# Altium schematic sheet Open Reactor Control System - Machine Interface MCU.SchDoc: ORC - Machine Interface MCU
size A3; Author: Peake J; CompanyName: Scion Research; DrawnBy: Peake J; Engineer: Peake J; Organization: Scion; Address1: 49 Sala St; Address2: Whakarewarewa; Address3: Rotorua; Address4: New Zealand 3010; DocumentNumber: 0-4; Revision: 0; SheetNumber: 3; SheetTotal: 5
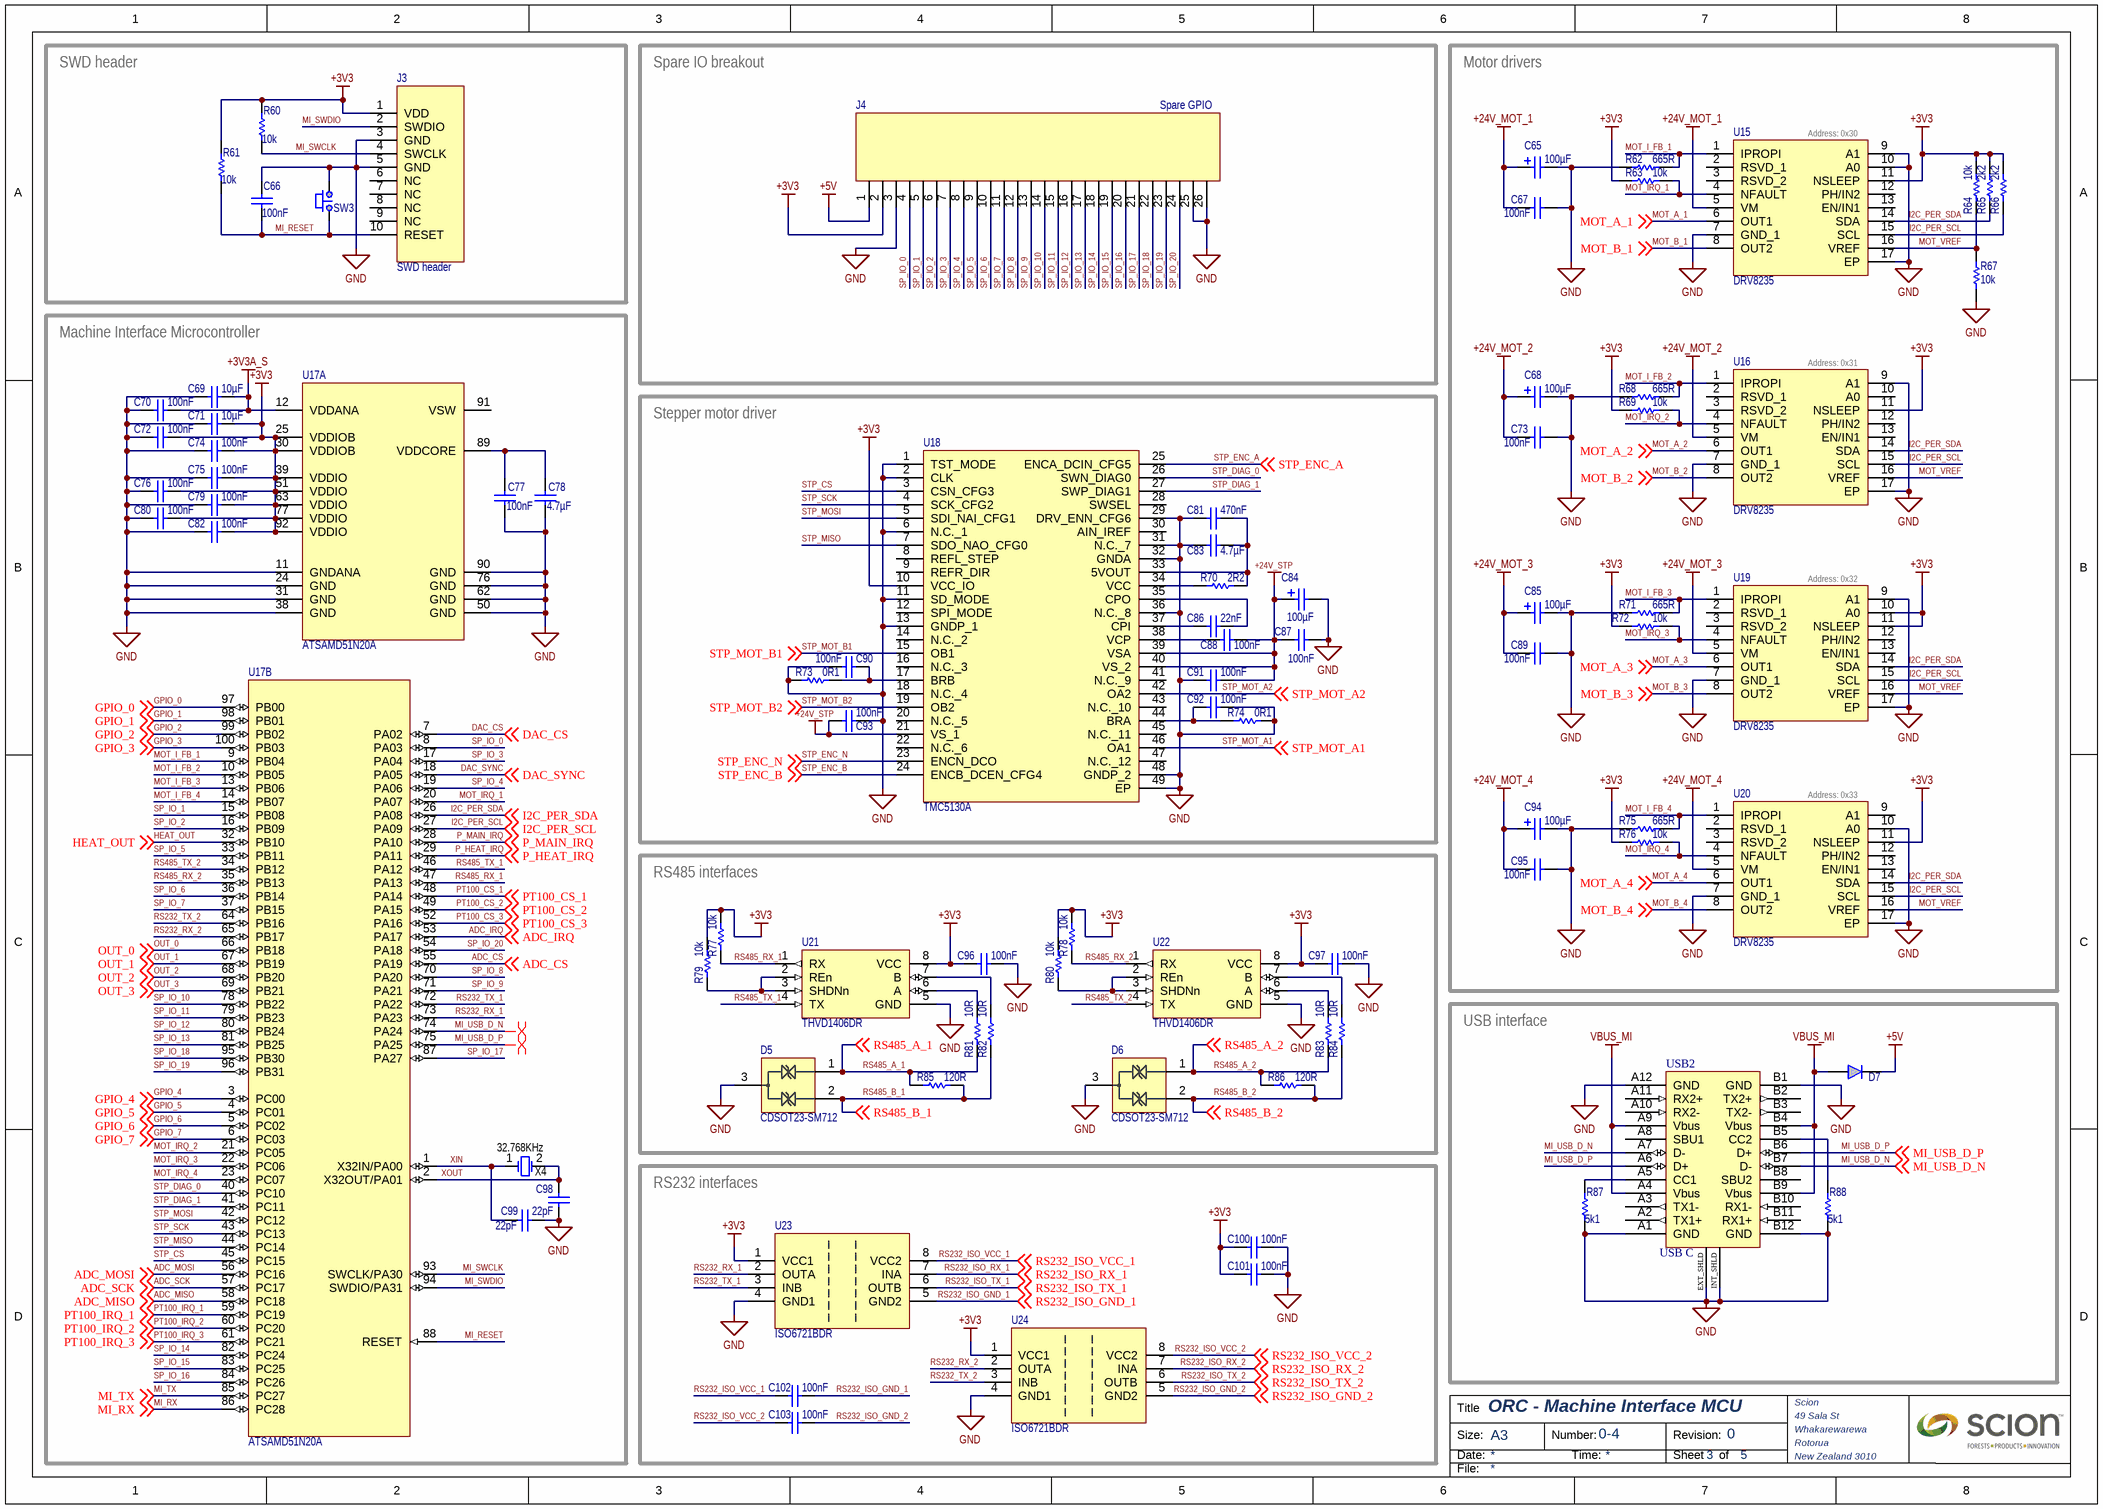
[diagram p0: Open Reactor Control System - Machine Interface MCU.SchDoc]

## Parts
C65  value 100µF  [CAP_PANA_F12_SIZE]  (hidden comment: Capacitor Electrolytic)
C66  value 100nF  [0603_CAP]  (hidden comment: Capacitor)
C67  value 100nF  [0603_CAP]  (hidden comment: Capacitor)
C68  value 100µF  [CAP_PANA_F12_SIZE]  (hidden comment: Capacitor Electrolytic)
C69  value 10µF  [0603_CAP]  (hidden comment: Capacitor)
C70  value 100nF  [0402_CAP]  (hidden comment: Capacitor)
C71  value 10µF  [0603_CAP]  (hidden comment: Capacitor)
C72  value 100nF  [0402_CAP]  (hidden comment: Capacitor)
C73  value 100nF  [0603_CAP]  (hidden comment: Capacitor)
C74  value 100nF  [0402_CAP]  (hidden comment: Capacitor)
C75  value 100nF  [0402_CAP]  (hidden comment: Capacitor)
C76  value 100nF  [0402_CAP]  (hidden comment: Capacitor)
C77  value 100nF  [0402_CAP]  (hidden comment: Capacitor)
C78  value 4.7µF  [0603_CAP]  (hidden comment: Capacitor)
C79  value 100nF  [0402_CAP]  (hidden comment: Capacitor)
C80  value 100nF  [0402_CAP]  (hidden comment: Capacitor)
C81  value 470nF  [0603_CAP]  (hidden comment: Capacitor)
C82  value 100nF  [0402_CAP]  (hidden comment: Capacitor)
C83  value 4.7µF  [0603_CAP]  (hidden comment: Capacitor)
C84  value 100µF  [CAP_PANA_F12_SIZE]  (hidden comment: Capacitor Electrolytic)
C85  value 100µF  [CAP_PANA_F12_SIZE]  (hidden comment: Capacitor Electrolytic)
C86  value 22nF  [0603_CAP]  (hidden comment: Capacitor)
C87  value 100nF  [0603_CAP]  (hidden comment: Capacitor)
C88  value 100nF  [0603_CAP]  (hidden comment: Capacitor)
C89  value 100nF  [0603_CAP]  (hidden comment: Capacitor)
C90  value 100nF  [0603_CAP]  (hidden comment: Capacitor)
C91  value 100nF  [0603_CAP]  (hidden comment: Capacitor)
C92  value 100nF  [0603_CAP]  (hidden comment: Capacitor)
C93  value 100nF  [0603_CAP]  (hidden comment: Capacitor)
C94  value 100µF  [CAP_PANA_F12_SIZE]  (hidden comment: Capacitor Electrolytic)
C95  value 100nF  [0603_CAP]  (hidden comment: Capacitor)
C96  value 100nF  [0603_CAP]  (hidden comment: Capacitor)
C97  value 100nF  [0603_CAP]  (hidden comment: Capacitor)
C98  value 22pF  [0402_CAP]  (hidden comment: Capacitor)
C99  value 22pF  [0402_CAP]  (hidden comment: Capacitor)
C100  value 100nF  [0603_CAP]  (hidden comment: Capacitor)
C101  value 100nF  [0603_CAP]  (hidden comment: Capacitor)
C102  value 100nF  [0603_CAP]  (hidden comment: Capacitor)
C103  value 100nF  [0603_CAP]  (hidden comment: Capacitor)
D5  CDSOT23-SM712  [FP-SOT23-IPC_C]
D6  CDSOT23-SM712  [FP-SOT23-IPC_C]
D7  Diode  [SOD-123]  (value not drawn)
J3  SWD header  [DIP10_1.27_M_SMD]
J4  Spare GPIO  [26_Pin DIL Male Header 2.54mm]
R60  value 10k  [0603_RES]  (hidden comment: Resistor)
R61  value 10k  [0603_RES]  (hidden comment: Resistor)
R62  value 665R  [0603_RES]  (hidden comment: Resistor)
R63  value 10k  [0603_RES]  (hidden comment: Resistor)
R64  value 10k  [0603_RES]  (hidden comment: Resistor)
R65  value 2k2  [0603_RES]  (hidden comment: Resistor)
R66  value 2k2  [0603_RES]  (hidden comment: Resistor)
R67  value 10k  [0603_RES]  (hidden comment: Resistor)
R68  value 665R  [0603_RES]  (hidden comment: Resistor)
R69  value 10k  [0603_RES]  (hidden comment: Resistor)
R70  value 2R2  [0603_RES]  (hidden comment: Resistor)
R71  value 665R  [0603_RES]  (hidden comment: Resistor)
R72  value 10k  [0603_RES]  (hidden comment: Resistor)
R73  value 0R1  [1206_RES]  (hidden comment: Resistor)
R74  value 0R1  [1206_RES]  (hidden comment: Resistor)
R75  value 665R  [0603_RES]  (hidden comment: Resistor)
R76  value 10k  [0603_RES]  (hidden comment: Resistor)
R77  value 10k  [0603_RES]  (hidden comment: Resistor)
R78  value 10k  [0603_RES]  (hidden comment: Resistor)
R79  value 10k  [0603_RES]  (hidden comment: Resistor)
R80  value 10k  [0603_RES]  (hidden comment: Resistor)
R81  value 10R  [0603_RES]  (hidden comment: Resistor)
R82  value 10R  [0603_RES]  (hidden comment: Resistor)
R83  value 10R  [0603_RES]  (hidden comment: Resistor)
R84  value 10R  [0603_RES]  (hidden comment: Resistor)
R85  value 120R  [0603_RES]  (hidden comment: Resistor)
R86  value 120R  [0603_RES]  (hidden comment: Resistor)
R87  value 5k1  [0603_RES]  (hidden comment: Resistor)
R88  value 5k1  [0603_RES]  (hidden comment: Resistor)
SW3  EVP-AAN02Q  [FP-EVP-AAN02Q-MFG]  (value not drawn)
U15  DRV8235  [DRV8235-Footprint-1]
U16  DRV8235  [DRV8235-Footprint-1]
U17  ATSAMD51N20A  [FP-C04-110-IPC_C]  (parts A,B of 2)
U18  TMC5130A  [TMC5130A-Footprint-1]
U19  DRV8235  [DRV8235-Footprint-1]
U20  DRV8235  [DRV8235-Footprint-1]
U21  THVD1406DR  [SOIC127P600X175-8N]
U22  THVD1406DR  [SOIC127P600X175-8N]
U23  ISO6721BDR  [SOIC127P600X175-8N]
U24  ISO6721BDR  [SOIC127P600X175-8N]
USB2  USB C  [GT-USB-7010ASV]
X4  32.768KHz  [ABRA-ABS07-2_V]

## Blocks framed on the sheet
SWD header: C66 J3 R60 R61 SW3
Spare IO breakout: J4
Motor drivers: C65 C67 C68 C73 C85 C89 C94 C95 R62-R69 R71 R72 R75 R76 U15 U16 U19 U20
Machine Interface Microcontroller: C69-C72 C74-C80 C82 C98 C99 U17 X4
Stepper motor driver: C81 C83 C84 C86-C88 C90-C93 R70 R73 R74 U18
RS485 interfaces: C96 C97 D5 D6 R77-R86 U21 U22
USB interface: D7 R87 R88 USB2
RS232 interfaces: C100-C103 U23 U24

## Nets
+3V3: C71.1 C72.1 C74.1 C75.1 C76.1 C79.1 C80.1 C82.1 C96.2 C97.2 C100.2 C101.2 J3.1(VDD) J4.2 R60.1 R61.1 R63.2 R64.2 R65.1 R66.1 R69.2 R72.2 R76.2 R77.1 R78.1 R79.1 R80.1 U15.11(NSLEEP) U16.11(NSLEEP) U17.25(VDDIOB) U17.30(VDDIOB) U17.39(VDDIO) U17.51(VDDIO) U17.63(VDDIO) U17.77(VDDIO) U17.92(VDDIO) U18.10(VCC_IO) U19.10(A0) U19.11(NSLEEP) U20.11(NSLEEP) U21.8(VCC) U22.8(VCC) U23.1(VCC1) U24.1(VCC1)
+3V3A_S: C69.1 C70.1 U17.12(VDDANA)
+5V: D7.1(K) J4.1
+24V_MOT_1: C65.1 C67.1 U15.5(VM)
+24V_MOT_2: C68.1 C73.1 U16.5(VM)
+24V_MOT_3: C85.1 C89.1 U19.5(VM)
+24V_MOT_4: C94.1 C95.1 U20.5(VM)
+24V_STP: C84.1 C87.1 C88.1 C91.2 C93.1 U18.21(VS_1) U18.39(VSA) U18.40(VS_2)
GND: C65.2 C66.1 C67.2 C68.2 C69.2 C70.2 C71.2 C72.2 C73.2 C74.2 C75.2 C76.2 C77.1 C78.1 C79.2 C80.2 C81.1 C82.2 C83.2 C84.2 C85.2 C87.2 C89.2 C90.1 C91.1 C92.2 C93.2 C94.2 C95.2 C96.1 C97.1 C98.2 C99.1 C100.1 C101.1 D5.3 D6.3 J3.3(GND) J3.5(GND) J4.3 J4.25 J4.26 R62.1 R67.1 R68.1 R71.1 R73.2 R74.1 R75.1 R87.2 R88.2 SW3.2 U15.7(GND_1) U15.9(A1) U15.10(A0) U15.17(EP) U16.7(GND_1) U16.9(A1) U16.17(EP) U17.11(GNDANA) U17.24(GND) U17.31(GND) U17.38(GND) U17.50(GND) U17.62(GND) U17.76(GND) U17.90(GND) U18.1(TST_MODE) U18.2(CLK) U18.6(N.C._1) U18.11(SD_MODE) U18.13(GNDP_1) U18.29(DRV_ENN_CFG6) U18.31(N.C._7) U18.32(GNDA) U18.36(N.C._8) U18.48(GNDP_2) U18.49(EP) U19.7(GND_1) U19.9(A1) U19.17(EP) U20.7(GND_1) U20.10(A0) U20.17(EP) U21.5(GND) U22.5(GND) U23.4(GND1) U24.4(GND1) USB2.A1(GND) USB2.A12(GND) USB2.B1(GND) USB2.B12(GND) USB2.EXT_SHLD USB2.INT_SHLD
VBUS_MI: D7.2(A) USB2.A4(Vbus) USB2.A9(Vbus) USB2.B4(Vbus) USB2.B9(Vbus)
ADC_CS: U17.55(PA19) ; off-sheet ADC_CS
ADC_IRQ: U17.53(PA17) ; off-sheet ADC_IRQ
ADC_MISO: U17.58(PC18) ; off-sheet ADC_MISO
ADC_MOSI: U17.56(PC16) ; off-sheet ADC_MOSI
ADC_SCK: U17.57(PC17) ; off-sheet ADC_SCK
DAC_CS: U17.7(PA02) ; off-sheet DAC_CS
DAC_SYNC: U17.18(PA05) ; off-sheet DAC_SYNC
GPIO_0: U17.97(PB00) ; off-sheet GPIO_0
GPIO_1: U17.98(PB01) ; off-sheet GPIO_1
GPIO_2: U17.99(PB02) ; off-sheet GPIO_2
GPIO_3: U17.100(PB03) ; off-sheet GPIO_3
GPIO_4: U17.3(PC00) ; off-sheet GPIO_4
GPIO_5: U17.4(PC01) ; off-sheet GPIO_5
GPIO_6: U17.5(PC02) ; off-sheet GPIO_6
GPIO_7: U17.6(PC03) ; off-sheet GPIO_7
HEAT_OUT: U17.32(PB10) ; off-sheet HEAT_OUT
I2C_PER_SCL: R66.2 U15.15(SCL) U16.15(SCL) U17.27(PA09) U19.15(SCL) U20.15(SCL) ; off-sheet I2C_PER_SCL
I2C_PER_SDA: R65.2 U15.14(SDA) U16.14(SDA) U17.26(PA08) U19.14(SDA) U20.14(SDA) ; off-sheet I2C_PER_SDA
MI_RESET: C66.2 J3.10(RESET) R61.2 SW3.1 U17.88(RESET)
MI_RX: U17.86(PC28) ; off-sheet MI_RX
MI_SWCLK: J3.4(SWCLK) R60.2 U17.93(SWCLK/PA30)
MI_SWDIO: J3.2(SWDIO) U17.94(SWDIO/PA31)
MI_TX: U17.85(PC27) ; off-sheet MI_TX
MI_USB_D_N: U17.74(PA24) USB2.A7(D-) USB2.B7(D-) ; off-sheet MI_USB_D_N
MI_USB_D_P: U17.75(PA25) USB2.A6(D+) USB2.B6(D+) ; off-sheet MI_USB_D_P
MOT_A_1: U15.6(OUT1) ; off-sheet MOT_A_1
MOT_A_2: U16.6(OUT1) ; off-sheet MOT_A_2
MOT_A_3: U19.6(OUT1) ; off-sheet MOT_A_3
MOT_A_4: U20.6(OUT1) ; off-sheet MOT_A_4
MOT_B_1: U15.8(OUT2) ; off-sheet MOT_B_1
MOT_B_2: U16.8(OUT2) ; off-sheet MOT_B_2
MOT_B_3: U19.8(OUT2) ; off-sheet MOT_B_3
MOT_B_4: U20.8(OUT2) ; off-sheet MOT_B_4
MOT_I_FB_1: R62.2 U15.1(IPROPI) U17.9(PB04)
MOT_I_FB_2: R68.2 U16.1(IPROPI) U17.10(PB05)
MOT_I_FB_3: R71.2 U17.13(PB06) U19.1(IPROPI)
MOT_I_FB_4: R75.2 U17.14(PB07) U20.1(IPROPI)
MOT_IRQ_1: R63.1 U15.4(NFAULT) U17.20(PA07)
MOT_IRQ_2: R69.1 U16.4(NFAULT) U17.21(PC05)
MOT_IRQ_3: R72.1 U17.22(PC06) U19.4(NFAULT)
MOT_IRQ_4: R76.1 U17.23(PC07) U20.4(NFAULT)
MOT_VREF: R64.1 R67.2 U15.16(VREF) U16.16(VREF) U19.16(VREF) U20.16(VREF)
OUT_0: U17.66(PB18) ; off-sheet OUT_0
OUT_1: U17.67(PB19) ; off-sheet OUT_1
OUT_2: U17.68(PB20) ; off-sheet OUT_2
OUT_3: U17.69(PB21) ; off-sheet OUT_3
P_HEAT_IRQ: U17.29(PA11) ; off-sheet P_HEAT_IRQ
P_MAIN_IRQ: U17.28(PA10) ; off-sheet P_MAIN_IRQ
PT100_CS_1: U17.48(PA14) ; off-sheet PT100_CS_1
PT100_CS_2: U17.49(PA15) ; off-sheet PT100_CS_2
PT100_CS_3: U17.52(PA16) ; off-sheet PT100_CS_3
PT100_IRQ_1: U17.59(PC19) ; off-sheet PT100_IRQ_1
PT100_IRQ_2: U17.60(PC20) ; off-sheet PT100_IRQ_2
PT100_IRQ_3: U17.61(PC21) ; off-sheet PT100_IRQ_3
RS232_ISO_GND_1: C102.1 U23.5(GND2) ; off-sheet RS232_ISO_GND_1
RS232_ISO_GND_2: C103.1 U24.5(GND2) ; off-sheet RS232_ISO_GND_2
RS232_ISO_RX_1: U23.7(INA) ; off-sheet RS232_ISO_RX_1
RS232_ISO_RX_2: U24.7(INA) ; off-sheet RS232_ISO_RX_2
RS232_ISO_TX_1: U23.6(OUTB) ; off-sheet RS232_ISO_TX_1
RS232_ISO_TX_2: U24.6(OUTB) ; off-sheet RS232_ISO_TX_2
RS232_ISO_VCC_1: C102.2 U23.8(VCC2) ; off-sheet RS232_ISO_VCC_1
RS232_ISO_VCC_2: C103.2 U24.8(VCC2) ; off-sheet RS232_ISO_VCC_2
RS232_RX_1: U17.73(PA23) U23.2(OUTA)
RS232_RX_2: U17.65(PB17) U24.2(OUTA)
RS232_TX_1: U17.72(PA22) U23.3(INB)
RS232_TX_2: U17.64(PB16) U24.3(INB)
RS485_A_1: D5.1 R81.1 R85.1 ; off-sheet RS485_A_1
RS485_A_2: D6.1 R83.1 R86.1 ; off-sheet RS485_A_2
RS485_B_1: D5.2 R82.1 R85.2 ; off-sheet RS485_B_1
RS485_B_2: D6.2 R84.1 R86.2 ; off-sheet RS485_B_2
RS485_RX_1: R77.2 U17.47(PA13) U21.1(RX)
RS485_RX_2: R78.2 U17.35(PB13) U22.1(RX)
RS485_TX_1: U17.46(PA12) U21.4(TX)
RS485_TX_2: U17.34(PB12) U22.4(TX)
SP_IO_0: J4.4 U17.8(PA03)
SP_IO_1: J4.5 U17.15(PB08)
SP_IO_2: J4.6 U17.16(PB09)
SP_IO_3: J4.7 U17.17(PA04)
SP_IO_4: J4.8 U17.19(PA06)
SP_IO_5: J4.9 U17.33(PB11)
SP_IO_6: J4.10 U17.36(PB14)
SP_IO_7: J4.11 U17.37(PB15)
SP_IO_8: J4.12 U17.70(PA20)
SP_IO_9: J4.13 U17.71(PA21)
SP_IO_10: J4.14 U17.78(PB22)
SP_IO_11: J4.15 U17.79(PB23)
SP_IO_12: J4.16 U17.80(PB24)
SP_IO_13: J4.17 U17.81(PB25)
SP_IO_14: J4.18 U17.82(PC24)
SP_IO_15: J4.19 U17.83(PC25)
SP_IO_16: J4.20 U17.84(PC26)
SP_IO_17: J4.21 U17.87(PA27)
SP_IO_18: J4.22 U17.95(PB30)
SP_IO_19: J4.23 U17.96(PB31)
SP_IO_20: J4.24 U17.54(PA18)
STP_CS: U17.45(PC15) U18.3(CSN_CFG3)
STP_DIAG_0: U17.40(PC10) U18.26(SWN_DIAG0)
STP_DIAG_1: U17.41(PC11) U18.27(SWP_DIAG1)
STP_ENC_A: U18.25(ENCA_DCIN_CFG5) ; off-sheet STP_ENC_A
STP_ENC_B: U18.24(ENCB_DCEN_CFG4) ; off-sheet STP_ENC_B
STP_ENC_N: U18.23(ENCN_DCO) ; off-sheet STP_ENC_N
STP_MISO: U17.44(PC14) U18.7(SDO_NAO_CFG0)
STP_MOSI: U17.42(PC12) U18.5(SDI_NAI_CFG1)
STP_MOT_A1: U18.46(OA1) ; off-sheet STP_MOT_A1
STP_MOT_A2: U18.42(OA2) ; off-sheet STP_MOT_A2
STP_MOT_B1: U18.15(OB1) ; off-sheet STP_MOT_B1
STP_MOT_B2: U18.19(OB2) ; off-sheet STP_MOT_B2
STP_SCK: U17.43(PC13) U18.4(SCK_CFG2)
XIN: C99.2 U17.1(X32IN/PA00) X4.1(OSC1)
XOUT: C98.1 U17.2(X32OUT/PA01) X4.2(OSC2)
NetC77_2: C77.2 C78.2 U17.89(VDDCORE)
NetC81_2: C81.2 C83.1 R70.1 U18.33(5VOUT)
NetC86_1: C86.1 U18.37(CPI)
NetC86_2: C86.2 U18.35(CPO)
NetC88_2: C88.2 U18.38(VCP)
NetC90_2: C90.2 R73.1 U18.17(BRB)
NetC92_1: C92.1 R74.2 U18.44(BRA)
NetR70_2: R70.2 U18.34(VCC)
NetR79_2: R79.2 U21.2(REn) U21.3(SHDNn)
NetR80_2: R80.2 U22.2(REn) U22.3(SHDNn)
NetR81_2: R81.2 U21.6(A)
NetR82_2: R82.2 U21.7(B)
NetR83_2: R83.2 U22.6(A)
NetR84_2: R84.2 U22.7(B)
NetR87_1: R87.1 USB2.A5(CC1)
NetR88_1: R88.1 USB2.B5(CC2)

Not connected (* = marked no-connect by the designer): J3 6(NC) 7(NC) 8(NC) 9(NC); U15 2(RSVD_1) 3(RSVD_2) 12(PH/IN2) 13(EN/IN1); U16 2(RSVD_1) 3(RSVD_2) 10(A0) 12(PH/IN2) 13(EN/IN1); U17 91(VSW); U18 8(REFL_STEP) 9(REFR_DIR) 12(SPI_MODE) 14(N.C._2) 16(N.C._3) 18(N.C._4) 20(N.C._5) 22(N.C._6) 28(SWSEL) 30(AIN_IREF) 41(N.C._9) 43(N.C._10) 45(N.C._11) 47(N.C._12); U19 2(RSVD_1) 3(RSVD_2) 12(PH/IN2) 13(EN/IN1); U20 2(RSVD_1) 3(RSVD_2) 9(A1) 12(PH/IN2) 13(EN/IN1); USB2 A2(TX1+) A3(TX1-) A8(SBU1) A10(RX2-) A11(RX2+) B2(TX2+) B3(TX2-) B8(SBU2) B10(RX1-) B11(RX1+)

## Layout directives
differential pair: MI_USB_D_N, MI_USB_D_P

## Notes on the sheet
- (near U15) Address: 0x30
- (near U16) Address: 0x31
- (near U19) Address: 0x32
- (near U20) Address: 0x33
- Title
- Size:
- Date:
- A3
- Number:
- Time:
- Revision:
- Sheet
- of
- File:

## Library data of the parts
C65 C68 C84 C85 C94 = CMP-001-00173-1: SMD Electrolytic Capacitor; Pins: 2; Component Type: Standard; MFN: *; Source: Discrete.SchLib; Design Item ID: Capacitor Electrolytic
C66 C67 C69-C83 C86-C93 C95-C103 = CMP-001-00172-2: SMD Capacitor; Pins: 2; Source: Discrete.SchLib; Design Item ID: Capacitor; Component Type: Standard
D5 D6 = CDSOT23-SM712-3: Trans Voltage Suppressor Diode, 400W, 7V V(RWM), Bidirectional, 2 Element, Silicon; Number of Elements: 2; Min Breakdown Voltage: 7.5V; Qualification Status: Not Qualified; Clamping Voltage-Max: 19V; Reference Standard: IEC-61000-4-2; Package Body Material: Plastic; Technology: AVALANCHE; JESD-30 Code: R-PDSO-G3; Moisture Sensitivity Level: 1; Polarity: Bidirectional; Diode Element Material: SILICON; Rep Pk Reverse Voltage-Max: 7V; JESD-609 Code: e3; Non-rep Peak Rev Power Dis-Max: 400W; Diode Type: TRANS VOLTAGE SUPPRESSOR; Package Style: SMALL OUTLINEMeter; Pins: 3; Surface Mount: Yes; Breakdown Voltage-Nom: 7.5V; Reach SVHC Compliant: Yes; Package Shape: Rectangular; Terminal Form: Gull Wing; RoHS Compliant: Yes; Terminal Position: DUAL; Terminal Finish: Tin
D7 = CMP-004-00083-4: SMD Diode; Design Item ID: Diode; Pins: 2; Source: Discrete.SchLib; Component Type: Standard; Pin Count: 2
J3 = CMP-002-00170-1: 10 Pin Connector; Component Type: Standard; Pins: 10; Source: Connectors.SchLib; Pin Count: 10; Design Item ID: 10_Pin
J4 = CMP-002-00004-1: 26 Pin Connector; Design Item ID: 30_Pin; Component Type: Standard; Source: Connectors.SchLib; Pin Count: 30; Pins: 32
R60-R86 = CMP-009-00356-1: SMD Resistor; Pins: 2; Source: Discrete.SchLib; Component Type: Standard; Design Item ID: Resistor
R87 R88 = CMP-009-00356-1: SMD Resistor; Value: 5k1; Pins: 2; Source: Discrete.SchLib; Component Type: Standard; Design Item ID: Resistor
SW3 = CMP-011-00000-2: Switch Tactile N.O. SPST Rectangular Button J-Bend 0.02A 15VDC 100000Cycles 5N SMD T/R
U15 U16 U19 U20 = CMP-00024-00001-1: Motor/Motion/Ignition Controllers & Drivers 38V 3.7A brushed DC motor driver with integrated speed regulation and stall detection
U17 = CMP-020-00002-2: RISC Microcontroller, 32-Bit, FLASH, 120MHz, CMOS, PQFP100
U18 = CMP-00024-00000-1: Universal high voltage controller/driver for two-phase bipolar stepper motor. StealthChop™ for quiet movement. Integrated MOSFETs for up to 2 A motor current per coil. With Step/Dir Interface and SPI.
U21 U22 = CMP-015-00008-1: Line Transceiver, 1 Func, 1 Driver, 1 Rcvr, PDSO8; RoHS Compliant: Yes
U23 U24 = CMP-015-00010-1: Interface Circuit, CMOS, PDSO8
USB2 = CMP-079-000004-4: Vertical or RA Type C Usb Connector Rohs Compliant: Yes; Pin Count: 26; Design Item ID: CMP-00005-5; Source: All Components - 30.06.23 - 18.27.SchLib; Component Type: Standard
X4 = CMP-003-00061-3: Low Profile Crystal, 32.768 kHz, +/- 20 ppm, 12.5 pF, -40 to 85 degC, 2-Pin SMD, Pb-Free, Tape and Reel; Manufacturer: Abracon; Tolerance: 20ppm; Load Capacitance: 12.5pF; ESR: 70k; Case/Package: CSMD; Datasheet Version: Aug-15; Pins: 2; Max Operating Temperature: 85°C; Package Description: 2-Pin Surface Mount Device, Body 3.2 x 1.5 mm; Manufacturer URL: http://www.abracon.com/; Package URL: http://www.abracon.com/Support/PackageDrawing/Resonators/ABS07.PDF; Min Operating Temperature: -40°C; Packaging: TapeandReel; RoHS Compliant: True; Package Reference: ABS07-2; Frequency Tolerance: 20ppm; Frequency: 32.768kHz; Datasheet URL: http://www.abracon.com/Resonators/ABS07.pdf; Package Quantity: 3000; Mounting Technology: SM; Component Type: Standard; Source: All Components - 30.06.23 - 18.27.SchLib; Design Item ID: CMP-003-00022-1